# Altium schematic sheet MCU.SchDoc
size A
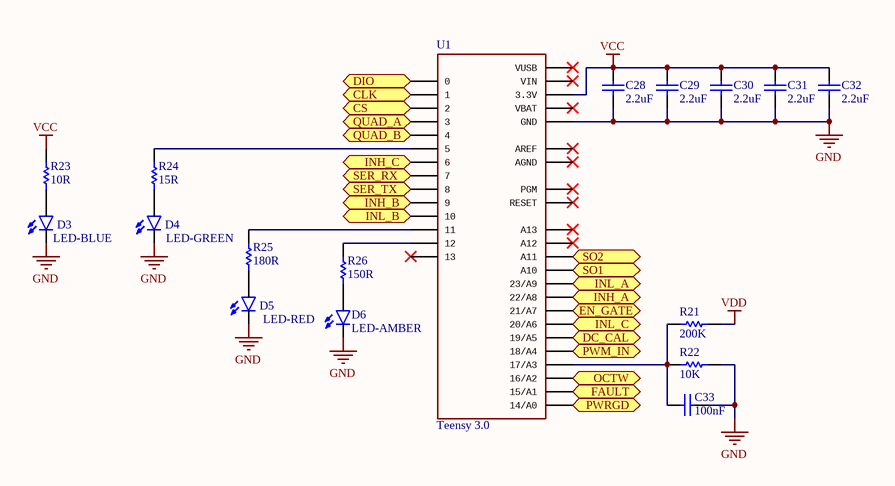
[diagram p0: MCU.SchDoc]

## Parts
C28  2.2uF  [CAPC0603(1608)55_N]
C29  2.2uF  [CAPC0603(1608)55_N]
C30  2.2uF  [CAPC0603(1608)55_N]
C31  2.2uF  [CAPC0603(1608)55_N]
C32  2.2uF  [CAPC0603(1608)55_N]
C33  100nF  [CAPC0603(1608)100_L]
D3  LED-BLUE  [LED-1206]
D4  LED-GREEN  [LED-1206]
D5  LED-RED  [LED-1206]
D6  LED-AMBER  [LED-1206]
R21  200K  [RESC0603(1608)_M]
R22  10K  [RESC0603(1608)_N]
R23  10R  [RESC0603(1608)_N]
R24  15R  [RESC0603(1608)_N]
R25  180R  [RESC0603(1608)_N]
R26  150R  [RESC0603(1608)_N]
U1  Teensy 3.0  [TEENSY_3.0_ALLANALOG]

## Ports
CLK (out), CS (out), DC_CAL (out), DIO (in), EN_GATE (out), FAULT (in), INH_A (out), INH_B (out), INH_C (out), INL_A (out), INL_B (out), INL_C (out), OCTW (in), PWM_IN (in), PWRGD (in), QUAD_A (in), QUAD_B (in), SER_RX (in), SER_TX (in), SO1 (in), SO2 (in)

## Nets
GND: C28.1 C29.1 C30.1 C31.1 C32.1 C33.2 D3.C D4.C D5.C D6.C R22.2 U1.GND_GND1_GND2(GND)
VCC: C28.2 C29.2 C30.2 C31.2 C32.2 R23.2 U1.3.3V_3.3V1_3.3V2(3.3V)
VDD: R21.2
CLK: U1.1 ; port CLK
CS: U1.2 ; port CS
DC_CAL: U1.19/A5 ; port DC_CAL
DIO: U1.0 ; port DIO
EN_GATE: U1.21/A7 ; port EN_GATE
FAULT: U1.15/A1 ; port FAULT
INH_A: U1.22/A8 ; port INH_A
INH_B: U1.9 ; port INH_B
INH_C: U1.6 ; port INH_C
INL_A: U1.23/A9 ; port INL_A
INL_B: U1.10 ; port INL_B
INL_C: U1.20/A6 ; port INL_C
OCTW: U1.16/A2 ; port OCTW
PWM_IN: U1.18/A4 ; port PWM_IN
PWRGD: U1.14/A0 ; port PWRGD
QUAD_A: U1.3 ; port QUAD_A
QUAD_B: U1.4 ; port QUAD_B
SER_RX: U1.7 ; port SER_RX
SER_TX: U1.8 ; port SER_TX
SO1: U1.A10 ; port SO1
SO2: U1.A11 ; port SO2
NetC33_1: C33.1 R21.1 R22.1 U1.17/A3
NetD3_A: D3.A R23.1
NetD4_A: D4.A R24.1
NetD5_A: D5.A R25.1
NetD6_A: D6.A R26.1
NetR24_2: R24.2 U1.5
NetR25_2: R25.2 U1.11
NetR26_2: R26.2 U1.12

Not connected (* = marked no-connect by the designer): U1 13* A12* A13* AGND* AREF* PGM* RST(RESET)* VBAT* VIN* VUSB*

## Library data of the parts
C28-C32 = CMP-1035-02762-1: CAP 2.2uF 16V Â±10% 0603 (1608 Metric) Thickness 0.55mm SMD; Case-EIA: 0603; Case-Metric: 1608; Max Thickness: 0.55 mm; Technology: SMT; Value: 2.2uF; Rated Voltage: 16 V; Tolerance: Â±10%
C33 = CMP-1035-02591-1: CAP 100nF 50V Â±5% 0603 (1608 Metric) Thickness 1mm SMD; Case-Metric: 1608; Case-EIA: 0603; Rated Voltage: 50 V; Max Thickness: 1 mm; Tolerance: Â±5%; Technology: SMT; Value: 100nF
D3 = LED-BLUE1206: PROD_ID: DIO-09911
D4 = LED-GREEN1206: PROD_ID: DIO-00862
D5 = LED-RED1206: PROD_ID: DIO-09912
D6 = LED-AMBER1206
R21 = CMP-1012-00129-1: 200K 0.1W 5% 0603 (1608 Metric)  SMD; Case-EIA: 0603; Value: 200000.00 Ohm; Case-Metric: 1608; Technology: SMT; Power: 0.1 W; Tolerance: 5 %
R22 = CMP-1012-00098-1: 10K 0.1W 5% 0603 (1608 Metric)  SMD; Case-EIA: 0603; Value: 10000.00 Ohm; Case-Metric: 1608; Technology: SMT; Tolerance: 5 %; Power: 0.1 W
R23 = CMP-1012-00026-1: 10R 0.1W 5% 0603 (1608 Metric)  SMD; Case-Metric: 1608; Case-EIA: 0603; Value: 10.00 Ohm; Technology: SMT; Tolerance: 5 %; Power: 0.1 W
R24 = CMP-1012-00030-1: 15R 0.1W 5% 0603 (1608 Metric)  SMD; Case-EIA: 0603; Case-Metric: 1608; Value: 15.00 Ohm; Tolerance: 5 %; Technology: SMT; Power: 0.1 W
R25 = CMP-1012-00056-1: 180R 0.1W 5% 0603 (1608 Metric)  SMD; Value: 180.00 Ohm; Case-EIA: 0603; Case-Metric: 1608; Power: 0.1 W; Technology: SMT; Tolerance: 5 %
R26 = CMP-1012-00054-1: 150R 0.1W 5% 0603 (1608 Metric)  SMD; Case-EIA: 0603; Value: 150.00 Ohm; Case-Metric: 1608; Power: 0.1 W; Tolerance: 5 %; Technology: SMT
U1 = TEENSY_3.0_ALLANALOGPINS: pin to pad: 3.3V 3.3V1 3.3V2>3.3V+3.3V1+3.3V2 GND GND1 GND2>GND+GND1+GND2